# Altium schematic sheet [03]-HWBOOTSEQUENCE.SchDoc: Hardware Boot Sequenz
size A3; DocumentNumber: 3; Revision: 2.0; SheetNumber: 3; SheetTotal: 13
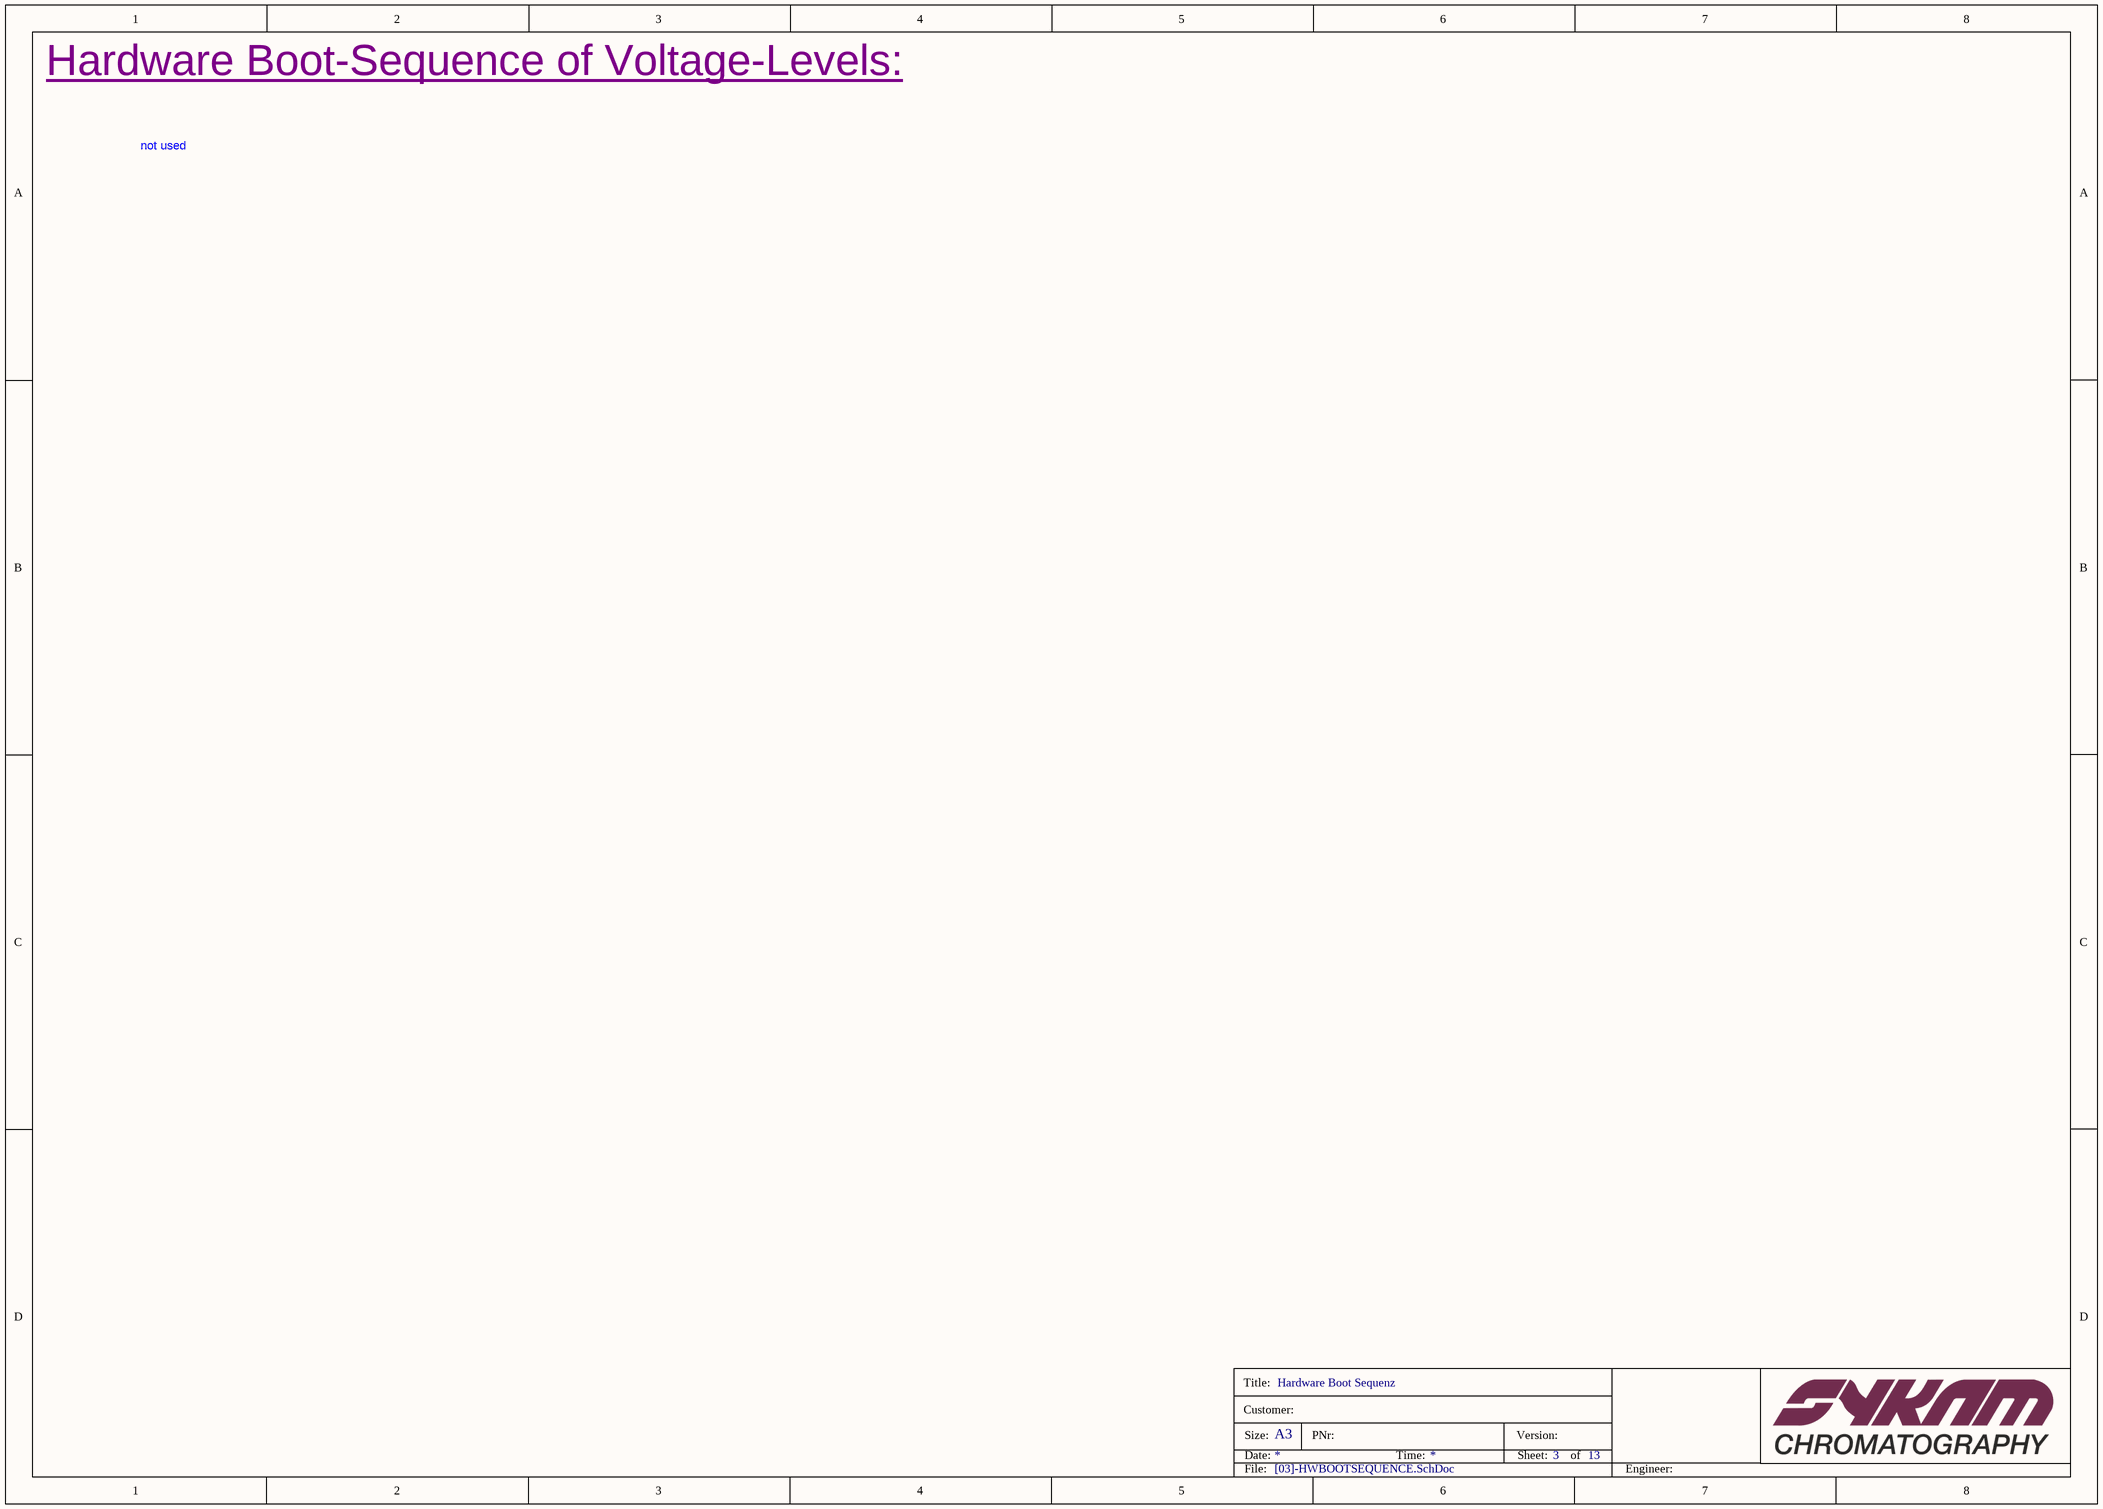
[diagram p0: [03]-HWBOOTSEQUENCE.SchDoc]

## Notes on the sheet
- Hardware Boot-Sequence of Voltage-Levels:
- not used
- Title:
- Customer:
- Size:
- Date:
- A3
- PNr:
- Time:
- Version:
- Sheet:
- of
- File:
- Engineer: